# Altium schematic sheet energy_router_panel_#2.SchDoc
size A4
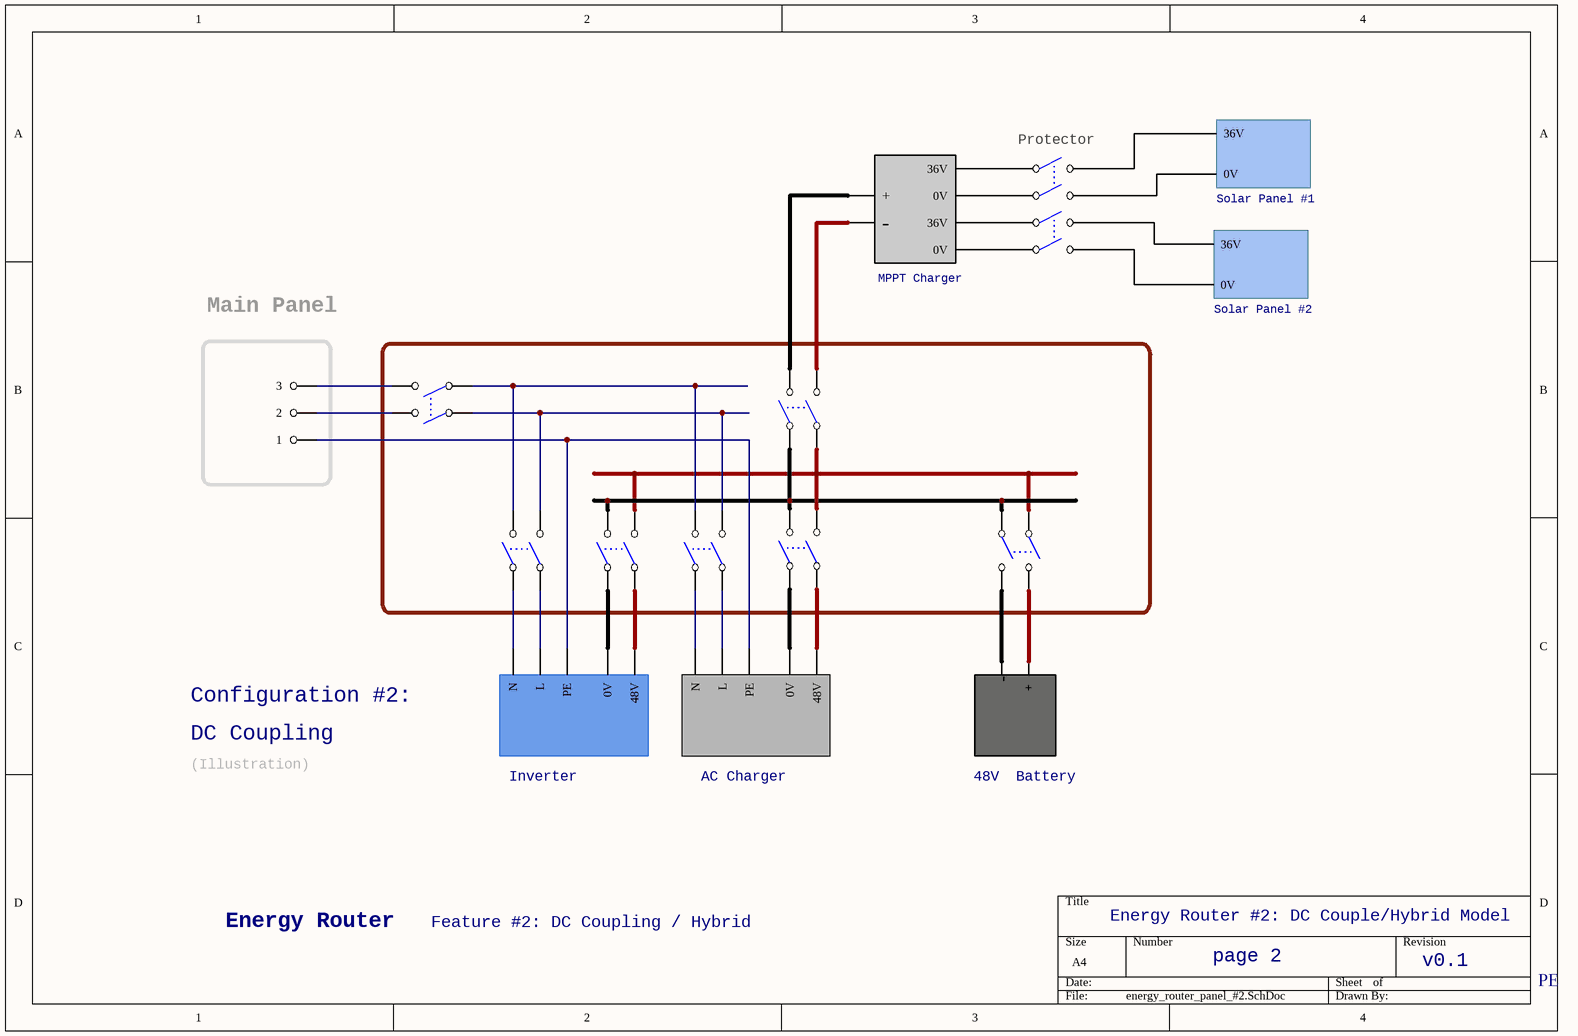
[diagram p0: energy_router_panel_#2.SchDoc]

## Parts
Battery1  48V  Battery
JP?  3 HEADER  (value not drawn)
K201  Switch  (value not drawn)
K202  Switch  (value not drawn)
K203  Switch  (value not drawn)
K204  Switch  (value not drawn)
K206  Switch  (value not drawn)
K207  Switch  (value not drawn)
K208  Switch  (value not drawn)
K211  Switch  (value not drawn)
K222  Switch  (value not drawn)
U21  Inverter
U201  MPPT Charger
U204  Solar Panel #1
U205  Solar Panel #2
U2092  AC Charger

## Nets
NetBattery1_1: Battery1.1(-) K204.4
NetBattery1_2: Battery1.2(+) K204.2
NetJP?_1: JP?.1 U21.3(PE) U2092.3(PE)
NetJP?_2: JP?.2 K201.2
NetJP?_3: JP?.3 K201.4
NetK201_1: K201.1 K202.4 K211.4
NetK201_3: K201.3 K202.2 K211.2
NetK202_1: K202.1 U21.1(N)
NetK202_3: K202.3 U21.2(L)
NetK203_1: K203.1 U21.4(0V)
NetK203_2: K203.2 K204.3 K206.1 K222.2
NetK203_3: K203.3 U21.5(48V)
NetK203_4: K203.4 K204.1 K206.3 K222.4
NetK206_2: K206.2 U201.2(+)
NetK206_4: K206.4 U201.1(-)
NetK207_1: K207.1 U201.7(36V)
NetK207_2: K207.2 U204.2(36V)
NetK207_3: K207.3 U201.6(0V)
NetK207_4: K207.4 U204.1(0V)
NetK208_1: K208.1 U201.5(36V)
NetK208_2: K208.2 U205.2(36V)
NetK208_3: K208.3 U201.4(0V)
NetK208_4: K208.4 U205.1(0V)
NetK211_1: K211.1 U2092.1(N)
NetK211_3: K211.3 U2092.2(L)
NetK222_1: K222.1 U2092.4(0V)
NetK222_3: K222.3 U2092.5(48V)

## Notes on the sheet
- (near K207) Protector
- Main Panel
- Configuration #2:
- (Illustration)
- DC Coupling
- Energy Router #2: DC Couple/Hybrid Model
- Energy Router
- Feature #2: DC Coupling / Hybrid
- page 2
- v0.1
- PE

## Library data of the parts
Battery1 = 1_BAT_48V
JP? = 3 HEADER: 3 Pin Header
K201-K204 K206-K208 K211 K222 = SW-DPST
U21 = 4_Inverter_Panel
U201 = 12_MPPT_Charger
U204 U205 = 10_Solar_Panel_36V
U2092 = 5_Charger_48V_Panel